# Altium schematic sheet Peripherals - Servos.SchDoc
size 420 x 297 mm; SheetNumber: 7; SheetTotal: 7
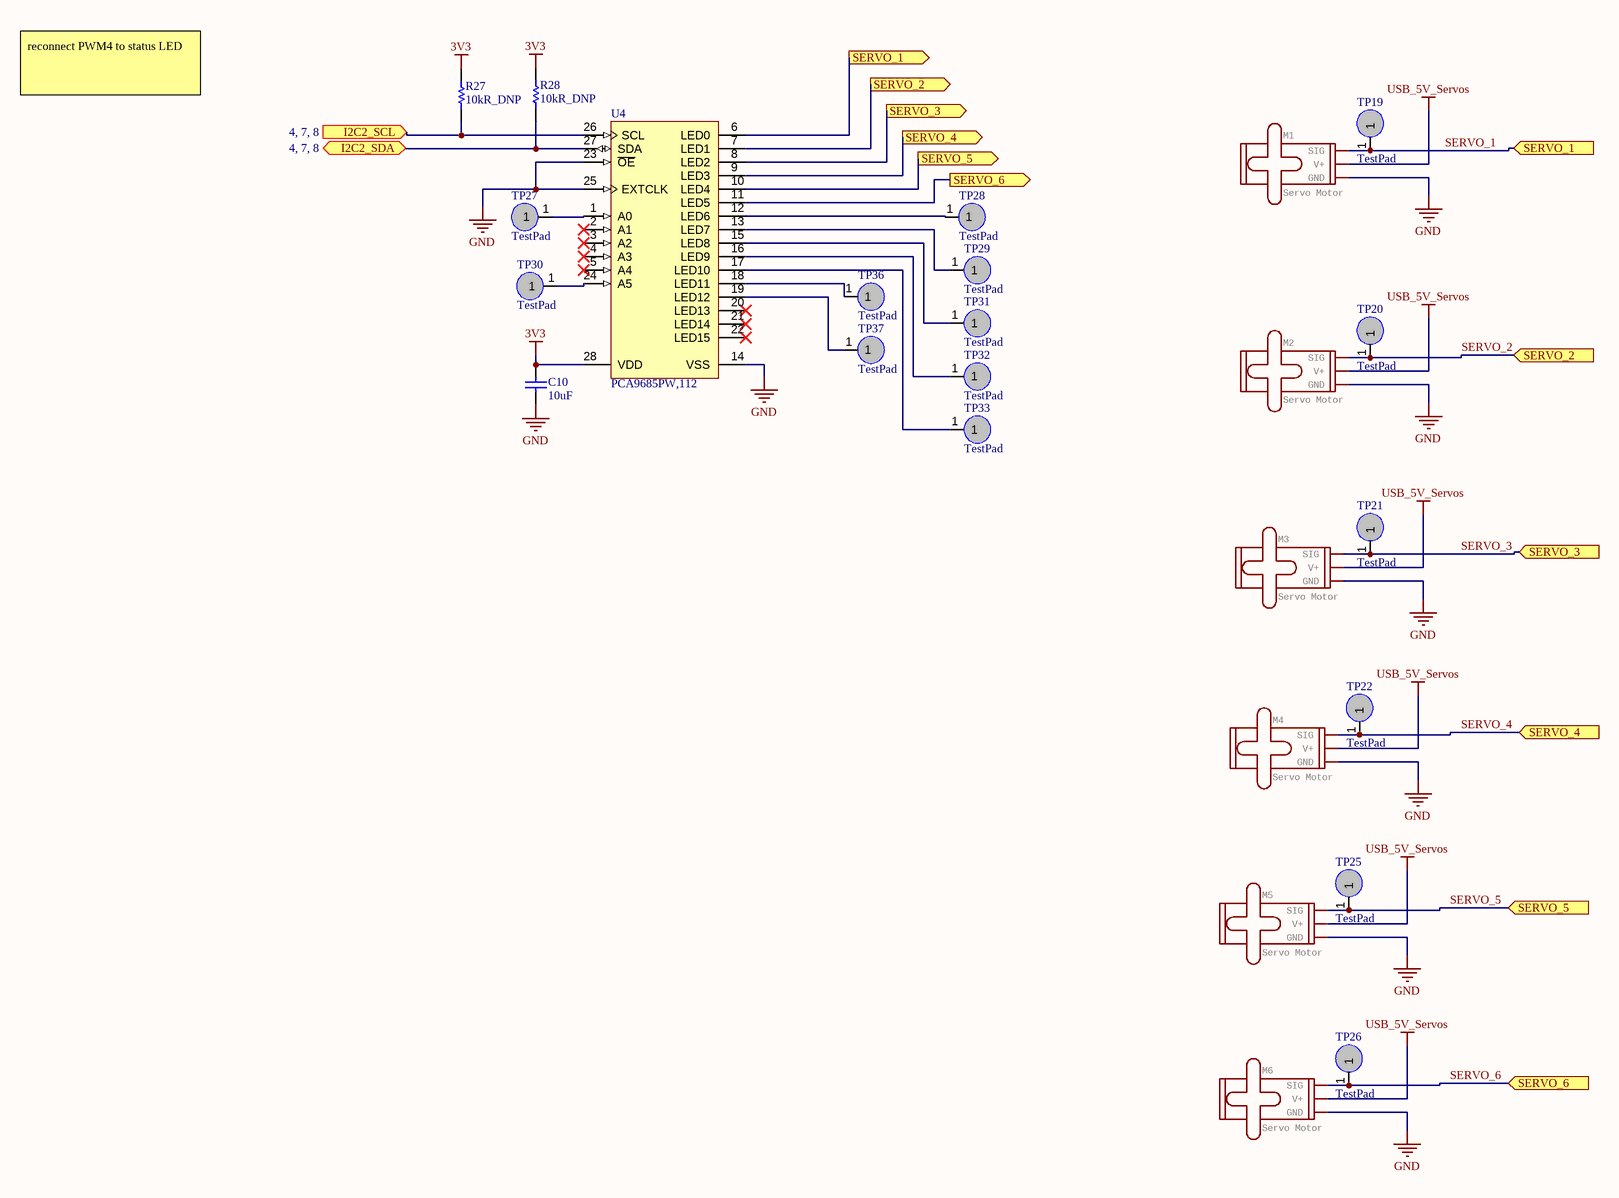
[diagram p0: Peripherals - Servos.SchDoc]

## Parts
C10  10uF  [CAPC2013X145X20ML20]
M1  Servo Motor  [1X03]
M2  Servo Motor  [1X03]
M3  Servo Motor  [1X03]
M4  Servo Motor  [1X03]
M5  Servo Motor  [1X03]
M6  Servo Motor  [1X03]
R27  10kR_DNP  [RESC2013X60X35NL10T20]
R28  10kR_DNP  [RESC2013X60X35NL10T20]
TP19  TestPad  [TestPad50mil]
TP20  TestPad  [TestPad50mil]
TP21  TestPad  [TestPad50mil]
TP22  TestPad  [TestPad50mil]
TP25  TestPad  [TestPad50mil]
TP26  TestPad  [TestPad50mil]
TP27  TestPad  [TestPad50mil]
TP28  TestPad  [TestPad50mil]
TP29  TestPad  [TestPad50mil]
TP30  TestPad  [TestPad50mil]
TP31  TestPad  [TestPad50mil]
TP32  TestPad  [TestPad50mil]
TP33  TestPad  [TestPad50mil]
TP36  TestPad  [TestPad50mil]
TP37  TestPad  [TestPad50mil]
U4  PCA9685PW,112  [SOT361-1_V]

## Ports
I2C2_SCL (in, see 4, 7, 8), I2C2_SDA (bidir, see 4, 7, 8), SERVO_1 (in), SERVO_1 (out), SERVO_2 (in), SERVO_2 (out), SERVO_3 (in), SERVO_3 (out), SERVO_4 (in), SERVO_4 (out), SERVO_5 (in), SERVO_5 (out), SERVO_6 (in), SERVO_6 (out)

## Nets
3V3: C10.2 R27.1 R28.1 U4.28(VDD)
GND: C10.1 M1.3(GND) M2.3(GND) M3.3(GND) M4.3(GND) M5.3(GND) M6.3(GND) U4.14(VSS) U4.23(~{OE}) U4.25(EXTCLK)
USB_5V_Servos: M1.2(V+) M2.2(V+) M3.2(V+) M4.2(V+) M5.2(V+) M6.2(V+)
I2C2_SCL: R27.2 U4.26(SCL) ; port I2C2_SCL
I2C2_SDA: R28.2 U4.27(SDA) ; port I2C2_SDA
SERVO_1: M1.1(SIG) TP19.1 U4.6(LED0) ; port SERVO_1
SERVO_2: M2.1(SIG) TP20.1 U4.7(LED1) ; port SERVO_2
SERVO_3: M3.1(SIG) TP21.1 U4.8(LED2) ; port SERVO_3
SERVO_4: M4.1(SIG) TP22.1 U4.9(LED3) ; port SERVO_4
SERVO_5: M5.1(SIG) TP25.1 U4.10(LED4) ; port SERVO_5
SERVO_6: M6.1(SIG) TP26.1 U4.11(LED5) ; port SERVO_6
NetTP27_1: TP27.1 U4.1(A0)
NetTP28_1: TP28.1 U4.12(LED6)
NetTP29_1: TP29.1 U4.13(LED7)
NetTP30_1: TP30.1 U4.24(A5)
NetTP31_1: TP31.1 U4.15(LED8)
NetTP32_1: TP32.1 U4.16(LED9)
NetTP33_1: TP33.1 U4.17(LED10)
NetTP36_1: TP36.1 U4.18(LED11)
NetTP37_1: TP37.1 U4.19(LED12)

Not connected (* = marked no-connect by the designer): U4 2(A1)* 3(A2)* 4(A3)* 5(A4)* 20(LED13)* 21(LED14)* 22(LED15)*

## Notes on the sheet
- reconnect PWM4 to status LED
- THIS DOCUMENT AND THE DATA DISCLOSED HEREIN OR
- HEREWITH IS THE PROPERTY OF ALTIUM LIMITED AND MAY
- DWG NO:
- REVISION
- REV:
- DESCRIPTION
- DATE
- APPROVED
- BE FREELY DISTRIBUTED IN WHOLE. NO RIGHTS ARE
- RESERVED OR EXPRESS OR IMPLIED WARANTEE GIVEN.
- ENG:
- APPROVALS
- PROJECT
- DSN:
- CHK:
- REFERENCE DOCUMENTS
- PROJECT REVISION:
- TITLE
- DOCUMENT REVISION:
- DESIGN ITEM:
- BOM:
- FAB DWG:
- PCB DWG:
- ASSY DWG:
- SCALE:
- A3
- SIZE
- CAGE CODE
- FILE NAME
- DWG NO.
- SHEET
- OF
- REV

## Library data of the parts
C10 = CMP-2000-05452-1: C2012X7R1A106K125AC Multilayer Ceramic Chip Capacitor, 10 uF, +/- 10%, 10 V, -55 to 125 degC, 0805 (2012 Metric), RoHS, Tape and Reel; Manufacturer: TDK; PCN Part Number: MLCCPartNumberChange30/Nov/2012; Capacitance: 10µF; Voltage - Rated: 10V; Product Training Modules: CSeriesGeneralApplicationsSEAT,CCV,andTVCLDesignToolsGuidetoReplacinganElectrolyticCapacitorwithanMLCC; Online Catalog: CSeries,GeneralPurpose; Other Names: 445-6857-6; Temperature Coefficient: X7R; Features: -; Ratings: -; Operating Temperature: -55degC~125degC; RoHS Information: RoHSCertificate-MLCC; Datasheet Version: Mar-15; Package / Case: 0805(2012Metric); Series: C; Mounting Type: SurfaceMount,MLCC; Family: CeramicCapacitors; Height - Seated (Max): -; Manufacturer URL: http://www.tdk.com/; Packaging: Digi-Reel; Tolerance: ±10%; Category: Capacitors; Applications: GeneralPurpose; Standard Package: 1; Size / Dimension: 0.079"Lx0.049"W(2.00mmx1.25mm); Datasheet URL: http://download.siliconexpert.com/pdfs/2015/4/21/15/54/45/779/tdk_/manual/37024850441143360mlcc_commercial_general_en.pdf; Lead Style: -; Lead Spacing: -; Thickness (Max): 0.057"(1.45mm); Package Reference: 805; Package Description: 2-Pin Surface Mount Device, Body 2 x 1.25 mm
M1-M6 = SERVO: GateName_1: G$1; SymbolName_1: SMALL_SERVO_MOTOR; LibraryName: SparkFun-Electromechanical; DeviceSetName: SERVO; Package: 1X03
R27 R28 = CMP-1659-00013-4: RC0805FR-0710KL Chip Resistor, 10 KOhm, +/- 1%, 0.125 W, -55 to 155 degC, 0805 (2012 Metric), RoHS, Tape and Reel; Manufacturer: Yageo; Voltage Rating: 150 V; Mount: Surface Mount; ComponentLink1Description: Manufacturer URL; ComponentLink2URL: http://www.yageo.com/documents/recent/PYu-RC_Group_51_RoHS_L_04.pdf; Pins: 2; Length: 2 mm; Min Operating Temperature: -55 degC; Height: 0.5 mm; Mounting Technology: Surface Mount; RoHSCompliant: true; REACH SVHC: No SVHC; ComponentLink1URL: http://www.yageo.com/; Max Operating Temperature: 155 degC; PackageReference: 0805; DatasheetVersion: Rev. 4, 02/2016; Package Quantity: 5000; Packaging: Tape and Reel; ComponentLink2Description: Datasheet; PackageDescription: 2-Pin Surface Mounted Device, Body 2 x 1.25 mm
U4 = CMP-1595-00004-2: 16-Channel, 12-Bit PWM Fm+ I2C-Bus LED Controller, 2.3 to 5.5 V, -40 to 85 degC, 28-Pin TSSOP (SOT361-1), RoHS, Tape and Reel; Supply Current Max: 10 mA; Supply Voltage Min: 2.3 V; Supply Voltage Max: 5.5 V; Frequency: 25000000 Hz; Temperature Min: -40 degC; PackageDescription: 28-Pin Small Outline Package, Body 9.7 x 4.4 mm, Pitch 0.65 mm; RoHS: TRUE; ComponentLink1Description: Manufacturer URL; Code_JEDEC: MO-153; PartNumber: PCA9685; ComponentLink2URL: http://www.nxp.com/documents/data_sheet/PCA9685.pdf; Packing: Tape and Reel; ComponentLink1URL: http://www.nxp.com/; ComponentLink3Description: Package Specification; ComponentLink2Description: Datasheet; ComponentLink3URL: http://www.nxp.com/documents/outline_drawing/sot361-1_po.pdf; DatasheetVersion: Rev. 4; Temperature Max: 85 degC; PackageVersion: 02/2003; Mounting Technology: Surface Mount